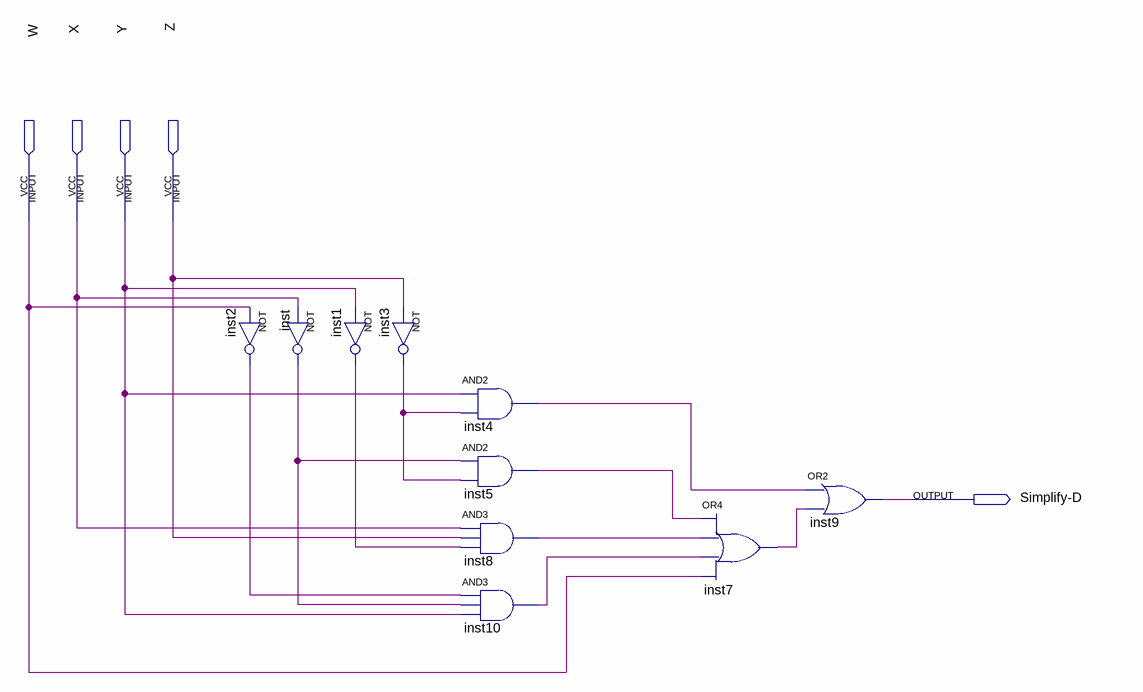
[diagram p0: schematic sheet]
// Quartus schematic Simplify-D.bdf as structural Verilog: 10 symbols, 5 pins
module \Simplify-D  (
  input  W,
  input  X,
  input  Y,
  input  Z,
  output \Simplify-D 
);

  wire inst1_out, inst2_out, inst3_out, inst4_out, inst5_out, inst7_out, inst8_out, inst10_out, inst_out;

  not inst2 (inst2_out, W);
  not inst (inst_out, X);
  not inst1 (inst1_out, Y);
  not inst3 (inst3_out, Z);
  and inst4 (inst4_out, Y, inst3_out);
  and inst5 (inst5_out, inst_out, inst3_out);
  and inst8 (inst8_out, X, Z, inst1_out);
  and inst10 (inst10_out, inst2_out, inst_out, Y);
  or inst7 (inst7_out, inst5_out, inst8_out, inst10_out, W);
  or inst9 (\Simplify-D , inst4_out, inst7_out);
endmodule
